# Altium schematic sheet Thumb.SchDoc
size Letter; CompanyName: Ploopy Corporation; Organization: Ploopy Corporation; Address1: 137-1140 Burnhamthorpe Road W; Address2: Mississauga; Address3: Ontario; Address4: Canada L5C 0A3; DocumentNumber: 1; Revision: R1.002; SheetNumber: 1; SheetTotal: 9
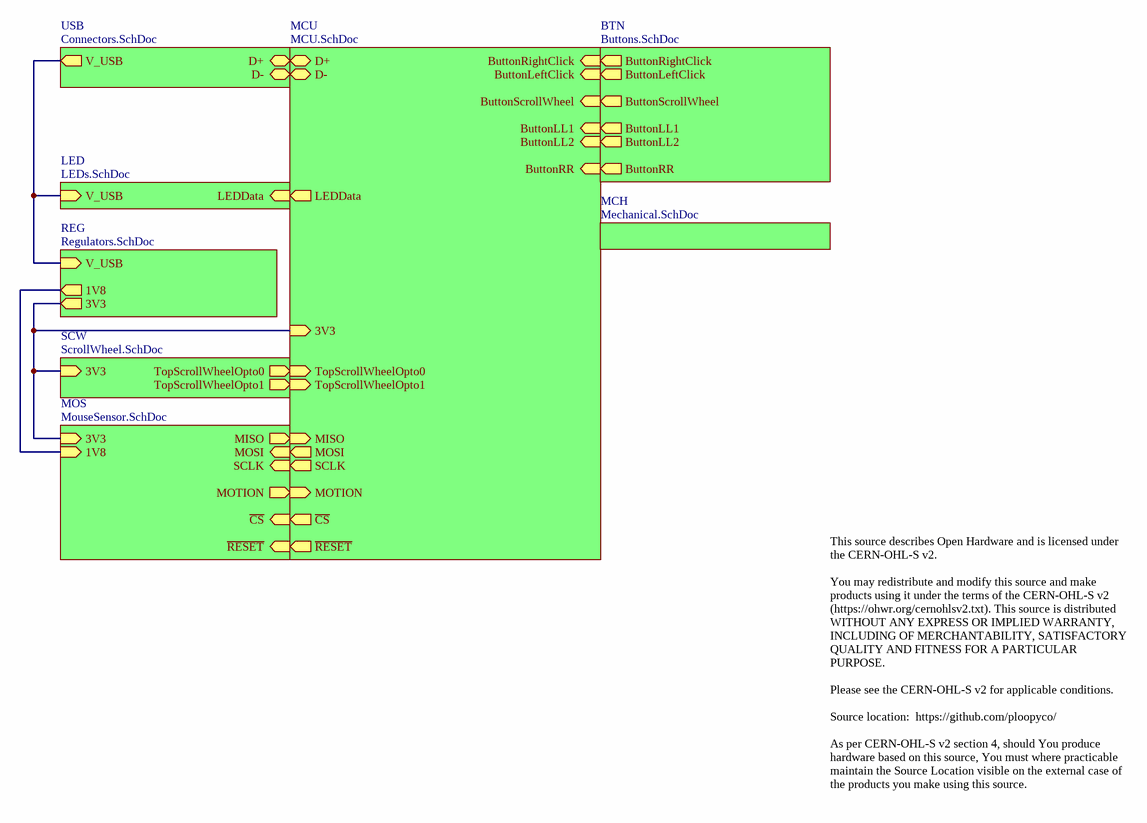
[diagram p0: Thumb.SchDoc]

## Sub-sheets
BTN = Buttons.SchDoc: ButtonRightClick (out), ButtonLeftClick (out), ButtonScrollWheel (out), ButtonLL1 (out), ButtonRR (out), ButtonLL2 (out)
LED = LEDs.SchDoc: V_USB (in), LEDData (in)
MCH = Mechanical.SchDoc: no entries
MCU = MCU.SchDoc: D+ (bidir), D- (bidir), ButtonRightClick (in), ButtonLeftClick (in), ButtonScrollWheel (in), ButtonLL1 (in), ButtonRR (in), ButtonLL2 (in), LEDData (out), 3V3 (in), TopScrollWheelOpto1 (in), TopScrollWheelOpto0 (in), MOSI (out), SCLK (out), MISO (in), ~{CS} (out), ~{RESET} (out), MOTION (in)
MOS = MouseSensor.SchDoc: 1V8 (in), 3V3 (in), ~{CS} (in), MISO (out), MOSI (in), SCLK (in), ~{RESET} (in), MOTION (out)
REG = Regulators.SchDoc: 3V3 (out), V_USB (in), 1V8 (out)
SCW = ScrollWheel.SchDoc: TopScrollWheelOpto1 (out), TopScrollWheelOpto0 (out), 3V3 (in)
USB = Connectors.SchDoc: D+ (bidir), V_USB (out), D- (bidir)

## Nets
(unnamed): sheet USB/D+, sheet MCU/D+
(unnamed): sheet USB/V_USB, sheet LED/V_USB, sheet REG/V_USB
(unnamed): sheet USB/D-, sheet MCU/D-
(unnamed): sheet LED/LEDData, sheet MCU/LEDData
(unnamed): sheet REG/3V3, sheet SCW/3V3, sheet MOS/3V3, sheet MCU/3V3
(unnamed): sheet REG/1V8, sheet MOS/1V8
(unnamed): sheet SCW/TopScrollWheelOpto1, sheet MCU/TopScrollWheelOpto1
(unnamed): sheet SCW/TopScrollWheelOpto0, sheet MCU/TopScrollWheelOpto0
(unnamed): sheet MOS/~{CS}, sheet MCU/~{CS}
(unnamed): sheet MOS/MISO, sheet MCU/MISO
(unnamed): sheet MOS/MOSI, sheet MCU/MOSI
(unnamed): sheet MOS/SCLK, sheet MCU/SCLK
(unnamed): sheet MOS/~{RESET}, sheet MCU/~{RESET}
(unnamed): sheet MOS/MOTION, sheet MCU/MOTION
(unnamed): sheet MCU/ButtonRightClick, sheet BTN/ButtonRightClick
(unnamed): sheet MCU/ButtonLeftClick, sheet BTN/ButtonLeftClick
(unnamed): sheet MCU/ButtonScrollWheel, sheet BTN/ButtonScrollWheel
(unnamed): sheet MCU/ButtonLL1, sheet BTN/ButtonLL1
(unnamed): sheet MCU/ButtonRR, sheet BTN/ButtonRR
(unnamed): sheet MCU/ButtonLL2, sheet BTN/ButtonLL2

## Notes on the sheet
- This source describes Open Hardware and is licensed under the CERN-OHL-S v2.
  You may redistribute and modify this source and make products using it under the terms of the CERN-OHL-S v2 (https://ohwr.org/cernohlsv2.txt). This source is distributed WITHOUT ANY EXPRESS OR IMPLIED WARRANTY, INCLUDING OF MERCHANTABILITY, SATISFACTORY QUALITY AND FITNESS FOR A PARTICULAR PURPOSE.
  Please see the CERN-OHL-S v2 for applicable conditions.
  Source location:  https://github.com/ploopyco/
  As per CERN-OHL-S v2 section 4, should You produce hardware based on this source, You must where practicable maintain the Source Location visible on the external case of the products you make using this source.
- Copyright Ploopy Corporation 2024
- Licensed under the CERN-OHL-S v2
- http://ohwr.org/cernohl
- Title:
- PCB:
- Version:
- Ploopy Corporation
- Mississauga ON L5C 0A3
- 137-1140 Burnhamthorpe Road W
- Date:
- Time:
- Sheet
- of
- Canada